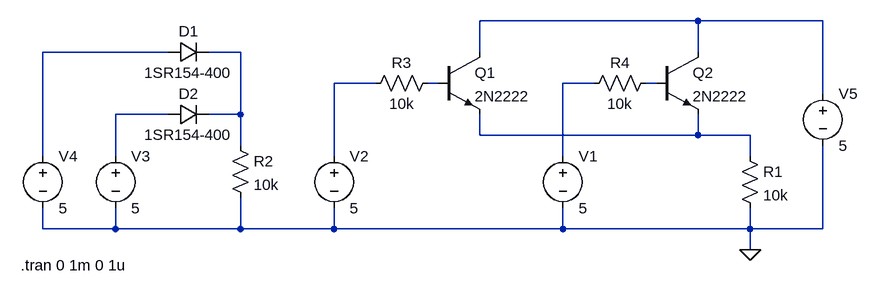
[diagram p0: schematic DL_vs_TTL.asc]
DL_vs_TTL.asc, the LTspice schematic file:
Version 4
SHEET 1 1144 680
WIRE 896 80 560 80
WIRE 1088 80 896 80
WIRE 80 128 -112 128
WIRE 192 128 144 128
WIRE 560 128 560 80
WIRE 896 128 896 80
WIRE 400 176 336 176
WIRE 496 176 480 176
WIRE 736 176 688 176
WIRE 832 176 816 176
WIRE 1088 192 1088 80
WIRE 80 224 0 224
WIRE 192 224 192 128
WIRE 192 224 144 224
WIRE 560 256 560 224
WIRE 896 256 896 224
WIRE 896 256 560 256
WIRE 976 256 896 256
WIRE 192 272 192 224
WIRE -112 288 -112 128
WIRE 0 288 0 224
WIRE 336 288 336 176
WIRE 688 288 688 176
WIRE 976 288 976 256
WIRE -112 400 -112 368
WIRE 0 400 0 368
WIRE 0 400 -112 400
WIRE 192 400 192 352
WIRE 192 400 0 400
WIRE 336 400 336 368
WIRE 336 400 192 400
WIRE 688 400 688 368
WIRE 688 400 336 400
WIRE 976 400 976 368
WIRE 976 400 688 400
WIRE 1088 400 1088 272
WIRE 1088 400 976 400
WIRE 976 432 976 400
FLAG 976 432 0
SYMBOL diode 80 144 R270
WINDOW 0 32 32 VTop 2
WINDOW 3 0 32 VBottom 2
SYMATTR InstName D1
SYMATTR Value 1SR154-400
SYMBOL diode 80 240 R270
WINDOW 0 32 32 VTop 2
WINDOW 3 0 32 VBottom 2
SYMATTR InstName D2
SYMATTR Value 1SR154-400
SYMBOL npn 496 128 R0
SYMATTR InstName Q1
SYMATTR Value 2N2222
SYMBOL npn 832 128 R0
SYMATTR InstName Q2
SYMATTR Value 2N2222
SYMBOL res 960 272 R0
SYMATTR InstName R1
SYMATTR Value 10k
SYMBOL res 176 256 R0
SYMATTR InstName R2
SYMATTR Value 10k
SYMBOL res 496 160 R90
WINDOW 0 0 56 VBottom 2
WINDOW 3 32 56 VTop 2
SYMATTR InstName R3
SYMATTR Value 10k
SYMBOL res 832 160 R90
WINDOW 0 0 56 VBottom 2
WINDOW 3 32 56 VTop 2
SYMATTR InstName R4
SYMATTR Value 10k
SYMBOL voltage 688 272 R0
WINDOW 123 0 0 Left 0
WINDOW 39 0 0 Left 0
SYMATTR InstName V1
SYMATTR Value 5
SYMBOL voltage 336 272 R0
WINDOW 123 0 0 Left 0
WINDOW 39 0 0 Left 0
SYMATTR InstName V2
SYMATTR Value 5
SYMBOL voltage 0 272 R0
WINDOW 123 0 0 Left 0
WINDOW 39 0 0 Left 0
SYMATTR InstName V3
SYMATTR Value 5
SYMBOL voltage -112 272 R0
WINDOW 123 0 0 Left 0
WINDOW 39 0 0 Left 0
SYMATTR InstName V4
SYMATTR Value 5
SYMBOL voltage 1088 176 R0
WINDOW 123 0 0 Left 0
WINDOW 39 0 0 Left 0
SYMATTR InstName V5
SYMATTR Value 5
TEXT -146 456 Left 2 !.tran 0 1m 0 1u

The netlist it stands for:
* DL_vs_TTL.asc
D1 N002 N003 1SR154-400
D2 N008 N003 1SR154-400
Q1 N001 N005 N009 0 2N2222
Q2 N001 N007 N009 0 2N2222
R1 N009 0 10k
R2 N003 0 10k
R3 N005 N004 10k
R4 N007 N006 10k
V1 N006 0 5
V2 N004 0 5
V3 N008 0 5
V4 N002 0 5
V5 N001 0 5
.model D D
.lib standard.dio
.model NPN NPN
.model PNP PNP
.lib standard.bjt
.tran 0 1m 0 1u
.backanno
.end